# EAGLE design DemoSensor (EAGLE 7.7.0)
CREVESION: 1.0; DESIGNER: Yveaux
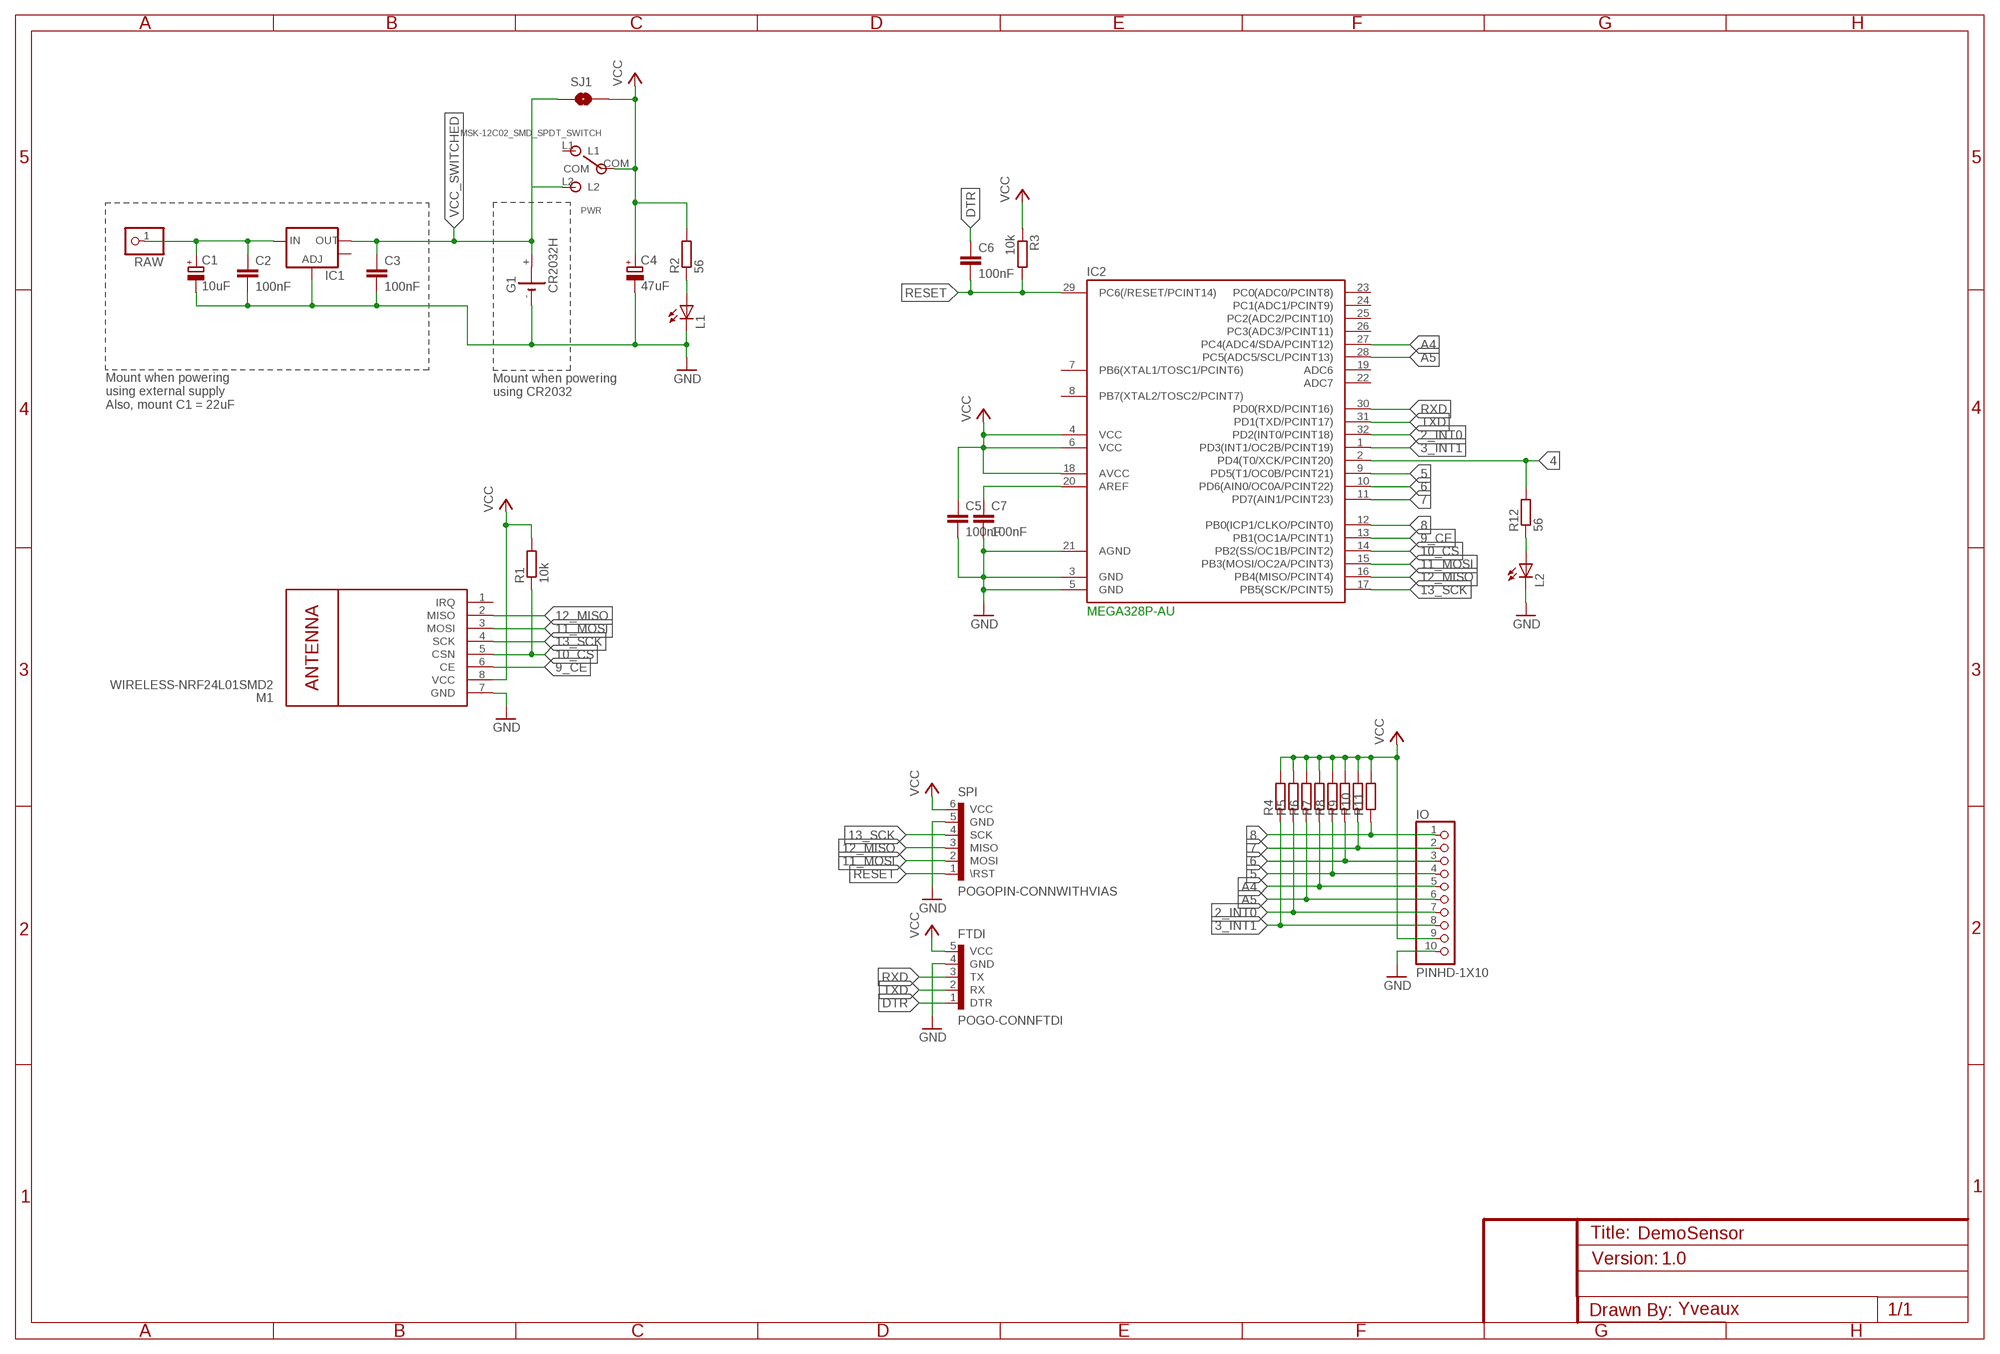
[diagram p0: schematic, sheet 1]

## Parts
C1  10uF  CPOL-EUSMCA  [SMC_A]
C2  100nF  C-EUC0603  [C0603]
C3  100nF  C-EUC0603  [C0603]
C4  47uF  CPOL-EUSMCA  [SMC_A]
C5  100nF  C-EUC0603  [C0603]
C6  100nF  C-EUC0603  [C0603]
C7  100nF  C-EUC0603  [C0603]
FTDI  POGO-CONNFTDI  [POGO5-VIAS]
G1  CR2032H  [CR2032H]
IC1  V_REG_LM1117SOT223  [SOT223]
IC2  MEGA328P-AU  MEGA48/88/168-AU  [TQFP32-08]
IO  PINHD-1X10  [1X10-BIG]
L1  LEDCHIPLED_0603  [CHIPLED_0603]
L2  LEDCHIPLED_0603  [CHIPLED_0603]
M1  WIRELESS-NRF24L01SMD2  [WIRELESS-NRF24L01-SMD-2]
PWR  MSK-12C02_SMD_SPDT_SWITCH  [MSK-12C02]
R1  10k  R-EU_R0603  [R0603]
R2  56  R-EU_R0603  [R0603]
R3  10k  R-EU_R0603  [R0603]
R4  R-EU_R0603  [R0603]
R5  R-EU_R0603  [R0603]
R6  R-EU_R0603  [R0603]
R7  R-EU_R0603  [R0603]
R8  R-EU_R0603  [R0603]
R9  R-EU_R0603  [R0603]
R10  R-EU_R0603  [R0603]
R11  R-EU_R0603  [R0603]
R12  56  R-EU_R0603  [R0603]
RAW  PINHD-1X1  [1X01]
SJ1  SOLDERJUMPERNO  [SJ_2S-NO]
SPI  POGOPIN-CONNWITHVIAS  [POGOPROG-CONN-0H]

## Nets
2_INT0: IC2.32(PD2(INT0/PCINT18)) IO.7 R5.1
3_INT1: IC2.1(PD3(INT1/OC2B/PCINT19)) IO.8 R4.1
4: IC2.2(PD4(T0/XCK/PCINT20)) R12.2
5: IC2.9(PD5(T1/OC0B/PCINT21)) IO.4 R8.1
6: IC2.10(PD6(AIN0/OC0A/PCINT22)) IO.3 R9.1
7: IC2.11(PD7(AIN1/PCINT23)) IO.2 R10.1
8: IC2.12(PB0(ICP1/CLKO/PCINT0)) IO.1 R11.1
9_CE: IC2.13(PB1(OC1A/PCINT1)) M1.6(CE)
10_CS: IC2.14(PB2(SS/OC1B/PCINT2)) M1.5(CSN) R1.1
11_MOSI: IC2.15(PB3(MOSI/OC2A/PCINT3)) M1.3(MOSI) SPI.2(MOSI)
12_MISO: IC2.16(PB4(MISO/PCINT4)) M1.2(MISO) SPI.3(MISO)
13_SCK: IC2.17(PB5(SCK/PCINT5)) M1.4(SCK) SPI.4(SCK)
A4: IC2.27(PC4(ADC4/SDA/PCINT12)) IO.5 R7.1
A5: IC2.28(PC5(ADC5/SCL/PCINT13)) IO.6 R6.1
DTR: C6.1 FTDI.1(DTR)
GND: C1.- C2.2 C3.2 C4.- C5.2 C7.2 FTDI.4(GND) G1.- IC1.1(ADJ) IC2.3(GND) IC2.5(GND) IC2.21(AGND) IO.10 L1.C L2.C M1.7(GND) SPI.5(GND)
N$2: L2.A R12.1
N$4: L1.A R2.1
N$18: C7.1 IC2.20(AREF)
RAW: C1.+ C2.1 IC1.3(IN) RAW.1
RESET: C6.2 IC2.29(PC6(/RESET/PCINT14)) R3.2 SPI.1(\RST)
RXD: FTDI.3(TX) IC2.30(PD0(RXD/PCINT16))
TXD: FTDI.2(RX) IC2.31(PD1(TXD/PCINT17))
VCC: C4.+ C5.1 FTDI.5(VCC) IC2.4(VCC) IC2.6(VCC) IC2.18(AVCC) IO.9 M1.8(VCC) PWR.COM R1.2 R2.2 R3.1 R4.2 R5.2 R6.2 R7.2 R8.2 R9.2 R10.2 R11.2 SJ1.2 SPI.6(VCC)
VCC_SWITCHED: C3.1 G1.+ IC1.2(OUT) PWR.L2 SJ1.1
Unconnected: IC1.4(OUT) IC2.7(PB6(XTAL1/TOSC1/PCINT6)) IC2.8(PB7(XTAL2/TOSC2/PCINT7)) IC2.19(ADC6) IC2.22(ADC7) IC2.23(PC0(ADC0/PCINT8)) IC2.24(PC1(ADC1/PCINT9)) IC2.25(PC2(ADC2/PCINT10)) IC2.26(PC3(ADC3/PCINT11)) M1.1(IRQ) PWR.L1

## Notes on the sheet
- Mount when powering
  using CR2032
- Mount when powering
  using external supply
  Also, mount C1 = 22uF
- 1.0
- Yveaux

## Library data of the parts
C1 C4 = rcl:CPOL-EU: POLARIZED CAPACITOR, European symbol
C2 C3 C5-C7 = rcl:C-EU: CAPACITOR, European symbol
FTDI = pogopin:POGO-CONN: Protofusion custom pogo pin programming header
G1 = battery_cr2032:CR2032H: LI BATTERY Varta
IC1 = SparkFun:V_REG_LM1117: Voltage Regulator LM1117 Standard adjustable voltage regulator but in SMD form. Spark Fun Electronics SKU : COM-00595
IC2 = avr-7:MEGA48/88/168
IO = adafruit:PINHD-1X10: Pin header 1x10 0.1" spacing With round pins
L1 L2 = adafruit:LED: LED OSRAM: - CHIPLED LG R971, LG N971, LY N971, LG Q971, LY Q971, LO R971, LY R971 LH N974, LH R974 LS Q976, LO Q976, LY Q976 LO Q996 - Hyper CHIPLED LW Q18S LB Q993, LB Q99A, LB R99A - SideLED LS A670, LO A670, LY A670, LG A670, LP A670 LB A673, LV A673, LT A673, LW A673 LH A674 LY A675 LS A676, LA A676, LO A676, LY A676, LW A676 LS A679, LY A679, LG A679 - Hyper Micro SIDELED® LS Y876, LA Y876, LO Y876, LY Y876 LT Y87S - SmartLED LW L88C, LW L88S LB L89C, LB L89S, LG L890 LS L89K, LO L89K, LY L89K LS L896, LA L896, LO L896, LY L896 - TOPLED LS T670, LO T670, LY T670, LG T670, LP T670 LSG T670, LSP T670, LSY T670, LOP T670, LYG T670 LG T671, LOG T671, LSG T671 LB T673, LV T673, LT T673, LW T673 LH T674 LS T676, LA T676, LO T676, LY T676, LB T676, LH T676, LSB T676, LW T676 LB T67C, LV T67C, LT T67C, LS T67K, LO T67K, LY T67K, LW E67C LS E67B, LA E67B, LO E67B, LY E67B, LB E67C, LV E67C, LT E67C LW T67C LS T679, LY T679, LG T679 LS T770, LO T770, LY T770, LG T770, LP T770 LB T773, LV T773, LT T773, LW T773 LH T774 LS E675, LA E675, LY E675, LS T675 LS T776, LA T776, LO T776, LY T776, LB T776 LHGB T686 LT T68C, LB T68C - Hyper Mini TOPLED® LB M676 - Mini TOPLED Santana® LG M470 LS M47K, LO M47K, LY M47K Source: http://www.osram.convergy.de/
M1 = nrf24l01plus:WIRELESS-NRF24L01: 2.4 GHz Wireless Module based on NRF24L01 chip
PWR = MSK SMD Micro Slider Switch SPDT:MSK-12C02_SMD_SPDT_SWITCH: Footprint of the VIMEX MSK-12C02 SPDT SMD Switch Created by mzst on 17-Jan-2016
R1-R12 = rcl:R-EU_: RESISTOR, European symbol
RAW = adafruit:PINHD-1X1: Pin header 1x1 for 0.1" spacing With round pins
SJ1 = SparkFun:SOLDERJUMPER: Solder Jumper Standard SMD solder jumper. Used to automate production. Two varients : Normally Open and Normally Closed are the same, but have different paste layers. NC will have a large amount of paste and should jumper during reflow.
SPI = Protofusion:POGOPIN-CONN: Protofusion custom pogo pin programming header

## Board
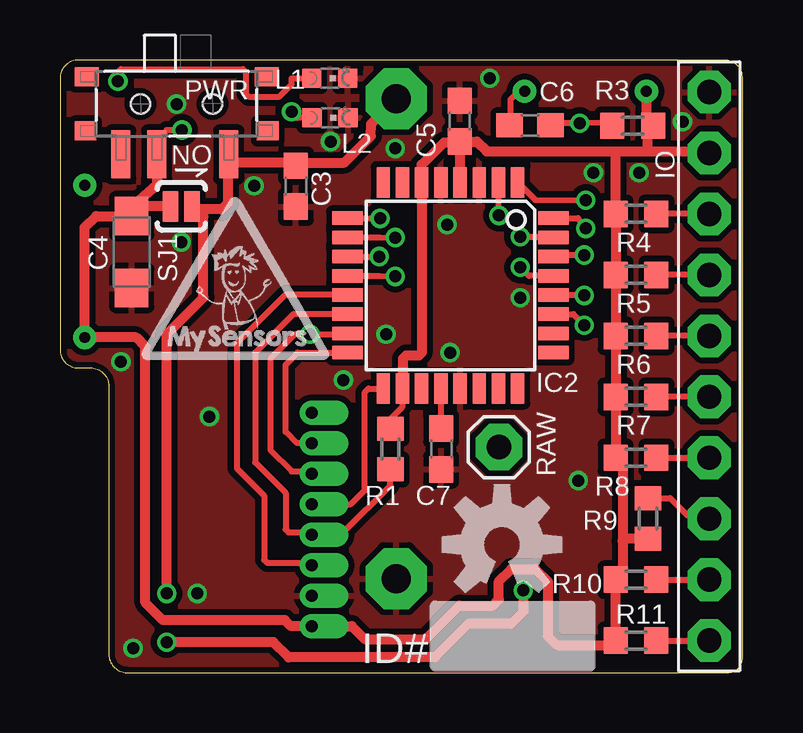
[diagram p1: board, top side]
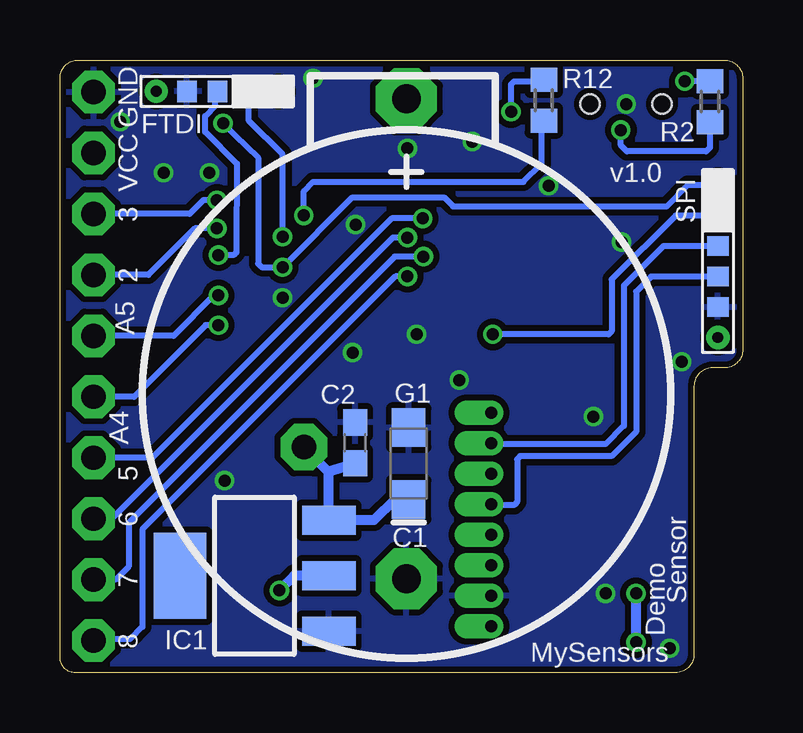
[diagram p2: board, bottom side, seen from below]

Size 28.45 x 25.53 mm. Coordinates in mm from the lower left corner, seen from the top.
Outline: 2.79,0 27.81,0 arc90 28.45,0.63 28.45,24.77 arc90 27.69,25.53 0.77,25.53 arc90 0,24.75 0,13.46 arc90 0.76,12.7 1.27,12.7 arc-90 2.03,11.94 2.03,0.76 arc90 2.79,0
Copper layers (1*16): Top 0.035mm / dielectric 1.5mm / Bottom 0.035mm
Design rules "dirt_cheap_dirty_boards.v1": minimum track width 5mil, minimum drill 12mil, track to track 5mil, track to pad 5mil, pad to pad 5mil, via to via 5mil, smd to smd 0mil, copper to edge 10mil, drill to drill 10mil, minimum pad ring 10mil, minimum via ring 6mil, stop-mask expansion 2mil, vias tented up to drill 25mil, thermal gap 10mil

### Footprints (pad centres in the part's own frame; a part is rotated, then mirrored left to right if it is on the bottom)
SMC_A = smd 1.6 x 1.4: + -1.5,0; - 1.5,0
C0603 = smd 1.1 x 1: 1 -0.85,0; 2 0.85,0
POGO5-VIAS = drill 0.457: 1 0,3.81; 5 0,-1.27 | smd 0.889 x 0.813: 2 0,2.54; 3 0,1.27; 4 0,0
CR2032H = drill 1.2 pad 2.54 octagon: + 0,13.3; - 0,-6.7
SOT223 = smd 1.219 x 2.235: 1 -2.311,-3.099; 2 0,-3.099; 3 2.311,-3.099 | smd 3.6 x 2.2: 4 0,3.099
TQFP32-08 = smd 1.27 x 0.559: 1 -4.293,2.8; 2 -4.293,2; 3 -4.293,1.2; 4 -4.293,0.4; 5 -4.293,-0.4; 6 -4.293,-1.2; 7 -4.293,-2; 8 -4.293,-2.8; 17 4.293,-2.8; 18 4.293,-2; 19 4.293,-1.2; 20 4.293,-0.4; 21 4.293,0.4; 22 4.293,1.2; 23 4.293,2; 24 4.293,2.8 | smd 0.559 x 1.27: 9 -2.8,-4.293; 10 -2,-4.293; 11 -1.2,-4.293; 12 -0.4,-4.293; 13 0.4,-4.293; 14 1.2,-4.293; 15 2,-4.293; 16 2.8,-4.293; 25 2.8,4.293; 26 2,4.293; 27 1.2,4.293; 28 0.4,4.293; 29 -0.4,4.293; 30 -1.2,4.293; 31 -2,4.293; 32 -2.8,4.293
1X10-BIG = drill 1.016 pad 1.778 octagon: 1 -11.43,0; 2 -8.89,0; 3 -6.35,0; 4 -3.81,0; 5 -1.27,0; 6 1.27,0; 7 3.81,0; 8 6.35,0; 9 8.89,0; 10 11.43,0
CHIPLED_0603 = smd 0.8 x 0.8: A 0,-0.75; C 0,0.75
WIRELESS-NRF24L01-SMD-2 = drill 0.5 pad 1.016 offset: 1 1.905,0; 2 1.905,1.27; 3 1.905,2.54; 4 1.905,3.81; 5 1.905,5.08; 6 1.905,6.35; 7 1.905,7.62; 8 1.905,8.89
MSK-12C02 = smd 0.8 x 2: COM 0.823,2.1; L1 2.323,2.1; L2 -2.177,2.1 | smd 1 x 0.8: GND@1 -3.75,-1.125; GND@4 3.75,-1.125 | smd 0.9 x 0.8: GND@2 -3.8,1.125; GND@3 3.8,1.125 | hole 0.8: -1.5,0; 1.5,0
R0603 = smd 1 x 1.1: 1 -0.85,0; 2 0.85,0
1X01 = drill 1.016 pad 1.93 octagon: 1 0,0
SJ_2S-NO = smd 0.635 x 1.27: 1 -0.45,0; 2 0.45,0
POGOPROG-CONN-0H = drill 0.457: 1 0,3.81; 6 0,-2.54 | smd 0.889 x 0.813: 2 0,2.54; 3 0,1.27; 4 0,0; 5 0,-1.27

### Placement (x,y rotation side)
C1  13.92,8.71 90 bottom
C2  16.15,9.58 90 bottom
C3  9.83,20.27 270 top
C4  2.98,17.53 270 top
C5  16.66,22.98 90 top
C6  19.59,22.8 0 top
C7  15.88,9.32 270 top
FTDI  23.16,24.22 270 bottom
G1  14.01,10.62 0 bottom
IC1  20.35,4.04 90 bottom
IC2  16.27,16.14 270 top
IO  27.05,12.76 90 top
L1  11.24,24.77 270 top
L2  11.25,23.12 270 top
M1  12.39,10.83 180 top
PWR  4.86,23.7 180 top
R1  13.77,9.32 90 top
R2  1.37,23.79 270 bottom
R3  23.87,22.79 180 top
R4  24,19.11 180 top
R5  24,16.57 180 top
R6  24,14.03 180 top
R7  24,11.49 180 top
R8  24,8.95 180 top
R9  24.5,6.43 270 top
R10  24,3.87 180 top
R11  24,1.33 180 top
R12  8.29,23.85 270 bottom
RAW  18.29,9.4 0 top
SJ1  5.05,19.43 180 top
SPI  1.03,16.5 0 bottom
U$5  [OSHW-LOGO-M]  18.41,5.33 0 top
U$6  [STICKER_8MM]  3.3,12.95 0 top

### Tracks (layer width: path | path; a pad name or v marks a point on that pad's centre or on a via)
2_INT0  (via drill 0.5 pad 0.25)
  Top 0.254: IO.7 R5.1 | v21.91,18.51 21.58,18.94 IC2.32 20.55,18.92
  Bottom 0.254: v21.91,18.51 22.83,18.51 24.77,16.57 IO.7
3_INT1  (via drill 0.5 pad 0.25)
  Top 0.254: IO.8 R4.1 | IC2.1 19.8,19.7 v21.91,19.68
  Bottom 0.254: v21.91,19.68 22.48,19.68 23.05,19.11 IO.8
4  (via drill 0.5 pad 0.25)
  Top 0.254: IC2.2 18.27,19.29 v18.29,19.05
  Bottom 0.254: v18.29,19.05 18.29,20.07 17.91,20.45 9.14,20.45 8.38,21.21 8.38,22.91 R12.2
5  (via drill 0.5 pad 0.25)
  Top 0.254: R8.1 IO.4 | IC2.9 v13.32,18.94 v13.33,18.92
  Bottom 0.254: v13.33,18.92 14.63,18.92 24.6,8.95 IO.4
6  (via drill 0.5 pad 0.25)
  Top 0.254: IC2.10 13.33,18.14 v13.97,18.13 | R9.1 25.43,7.28 26.16,6.54 26.92,6.54 IO.3
  Bottom 0.254: v13.97,18.13 14.57,18.13 26.32,6.38 27.02,6.38 IO.3
7  (via drill 0.5 pad 0.25)
  Top 0.254: R10.1 IO.2 | IC2.11 v13.3,17.34
  Bottom 0.254: v13.3,17.34 14.51,17.34 25.59,6.26 25.59,4.41 26.13,3.87 IO.2
8  (via drill 0.5 pad 0.25)
  Top 0.254: R11.1 IO.1 | IC2.12 13.31,16.54 v13.97,16.51
  Bottom 0.254: v13.97,16.51 14.48,16.51 25.02,5.97 25.02,1.91 25.53,1.4 26.99,1.4 IO.1
9_CE
  Top 0.254: IC2.13 9.38,15.73 7.37,13.72 7.37,8.51 8.51,7.37 8.51,4.7 8.64,4.57 10.45,4.57 M1.6
10_CS
  Top 0.254: IC2.14 9.73,14.94 8.13,13.34 8.13,8.76 9.4,7.49 9.4,5.97 9.53,5.84 10.45,5.84 | 10.45,5.84 M1.5 | 10.45,5.84 11.81,5.84 13.77,7.8 R1.1
11_MOSI  (via drill 0.5)
  Top 0.254: IC2.15 11.94,14.1 v10.41,14.1 9.78,14.1 8.76,13.08 8.76,9.27 9.65,8.38 10.45,8.38 M1.3
  Bottom 0.254: SPI.2 2.8,19.05 5.46,16.38 5.46,14.22 5.59,14.1 v10.41,14.1
12_MISO
  Top 0.254: M1.2 9.87,9.56 9.4,10.03 9.4,12.83 9.91,13.34 IC2.16
  Top 0.305: IC2.16
  Bottom 0.254: SPI.3 3.31,17.77 4.95,16.13 4.95,10.29 5.72,9.53 10.45,9.53 M1.2
13_SCK
  Top 0.254: M1.4 12.12,7.02 12.7,7.6 12.7,11.68 12.85,11.83 13.46,11.83
  Top 0.305: 13.46,11.83 IC2.17
  Bottom 0.254: SPI.4 3.81,16.5 4.44,15.88 4.44,10.03 5.46,9.02 9.27,9.02 9.4,8.89 9.4,7.11 9.53,6.98 10.45,6.98
  Bottom 0.305: 10.45,6.98 M1.4
A4  (via drill 0.5 pad 0.25)
  Top 0.254: IO.5 R7.1 | IC2.27 21.39,14.94 v21.84,14.48
  Bottom 0.254: v21.84,14.48 22.38,14.48 25.36,11.49 IO.5
A5  (via drill 0.5 pad 0.25)
  Top 0.254: IO.6 R6.1 | IC2.28 21.83,15.73 v21.84,15.72
  Bottom 0.254: v21.84,15.72 22.03,15.72 23.72,14.03 IO.6
DTR
  Top 0.254: FTDI.1 19.11,24.22 18.76,23.88 18.76,22.83 C6.1
GND  (via drill 0.5)
  other vias: 16.13,18.67 16.26,13.34 13.59,14.1 11.81,12.19 21.59,8 3.05,1.02 6.22,10.67 5.72,3.3 5.05,17.94 8.09,20.29 4.86,23.69 13.97,21.84 11.27,22.13 24.13,20.83 22.23,20.83 19.18,15.62 17.91,24.77 25.94,22.96 2.54,12.95
  pour Bottom (isolate 0.254): -0.38,25.91 28.83,25.78 28.83,-0.51 -0.38,-0.51
  pour Top (isolate 0.254): -0.25,26.04 28.83,26.04 28.83,-0.38 -0.25,-0.38
N$2  (via drill 0.5)
  Top 0.254: L2.A 9.9,23.12 v9.65,23.37
  Bottom 0.254: v9.65,23.37 9.65,24.51 9.53,24.64 8.35,24.64 R12.1
N$4  (via drill 0.5)
  Top 0.254: v2.41,24.64 2.41,25.02 2.54,25.15 7.62,25.15 7.75,25.02 7.75,24.13 7.87,24 9.14,24 9.65,24.51 9.65,24.77 9.91,24.77 L1.A
  Bottom 0.254: R2.1 v2.41,24.64
N$18
  Top 0.254: IC2.20 15.87,10.18 C7.1
RAW
  Bottom 0.406: 17.25,8.36 IC1.3 15.37,6.35 14.51,7.21 C1.+ | C2.1 17.25,8.4 17.25,8.36 | 17.25,8.36 RAW.1
RESET  (via drill 0.5, 0.5 pad 0.25)
  Top 0.254: IC2.29 19.53,16.54 v19.18,16.89 | 20.45,22.91 C6.2 20.53,22.89 v21.65,22.89 22.87,22.91 R3.2
  Bottom 0.254: SPI.1 2.29,20.32 3.17,19.43 12.06,19.43 12.44,19.81 16.26,19.81 v19.18,16.89 20.01,16.89 20.07,16.92 20.19,17.04 20.19,21.46 21.65,22.86 v21.65,22.89
RXD  (via drill 0.5 pad 0.25)
  Top 0.254: v21.84,17.4 20.63,17.4 IC2.30
  Bottom 0.254: v21.84,17.4 21.21,17.4 21.1,17.51 21.1,17.64 21.08,21.21 22.4,22.53 22.4,23.19 21.97,23.62 21.97,24.14 FTDI.3
TXD  (via drill 0.5 pad 0.25)
  Top 0.254: IC2.31 19.2,18.14 v19.18,18.16
  Bottom 0.254: v19.18,18.16 19.18,21.59 20.57,22.99 20.57,24.17 FTDI.2
VCC  (via drill 0.5)
  Top 0.254: v5.08,22.61 4.44,22.61 4.1,22.26 4.1,21.72 | 14.26,11.83 14.26,11.05 13.79,10.59 13.79,10.07 R1.2
  Top 0.406: 14.26,11.83 IC2.18 14.29,11.86 14.29,13.08 14.41,13.21 14.95,13.21 15.07,13.32 IC2.6 15.07,21.17 16,22.1 16.63,22.1 C5.1 | 3.05,18.71 C4.+ | C4.+ 1.5,19.03 1.02,18.54 1.02,13.98 SPI.6 3.17,13.97 3.56,13.59 3.56,2.92 4.28,2.19 9.37,2.19 9.62,1.94 M1.8 12.16,1.94 12.7,1.4 15.24,1.4 16.64,2.79 18.03,2.79 18.29,3.05 18.29,3.81 18.8,4.32 19.81,4.32 20.32,3.81 20.32,1.52 20.7,1.14 22.96,1.14 R11.2 R10.2 23.44,4.16 23.44,5.49 | 23.11,21.72 24.38,21.72 | 24.38,21.72 26.99,21.72 IO.9 | C5.1 17.37,22.13 17.78,21.72 23.11,21.72 | C5.1 IC2.4 | 23.11,21.72 23.15,21.68 R4.2 R5.2 R6.2 R7.2 R8.2 23.18,8.8 23.44,8.51 23.44,5.49 | FTDI.5 24.43,22.94 R3.1 24.53,22.91 24.45,22.83 24.46,21.8 24.38,21.72 | R9.2 23.53,5.58 23.44,5.49 | 2.97,19.39 4.03,20.33 PWR.COM 4.1,21.67 4.1,21.72 | 2.97,19.39 C4.+ | SJ1.2 3.47,19.43 2.97,19.39
  Bottom 0.254: R2.2 1.37,21.88 1.52,21.72 4.83,21.72 5.08,21.97 v5.08,22.61
VCC_SWITCHED  (via drill 0.5)
  Top 0.406: G1.+ 12.96,22.87 12.95,22.35 11.84,21.25 9.91,21.24 9.83,21.16 C3.1 9.75,21.24 8.35,21.25 7.39,21.25 | 7.39,21.25 PWR.L2 | v19.3,3.43 19.3,2.54 18.8,2.03 17.02,2.03 15.62,0.63 9.53,0.63 8.89,1.27 v4.44,1.27 | v4.44,3.3 4.44,14.1 5.97,15.62 5.97,19.01 SJ1.1 5.63,19.3 6.73,19.3 6.99,19.56 6.99,21.25 7.39,21.25
  Bottom 0.406: v4.44,1.27 v4.44,3.3 | IC1.2 18.69,4.04 v19.3,3.43

### Text on the board
tNames: ON | ID#
bNames: GND | VCC | v1.0 | 3 | 2 | A5 | A4 | 5 | 6 | Sensor | 7 | Demo | 8 | MySensors